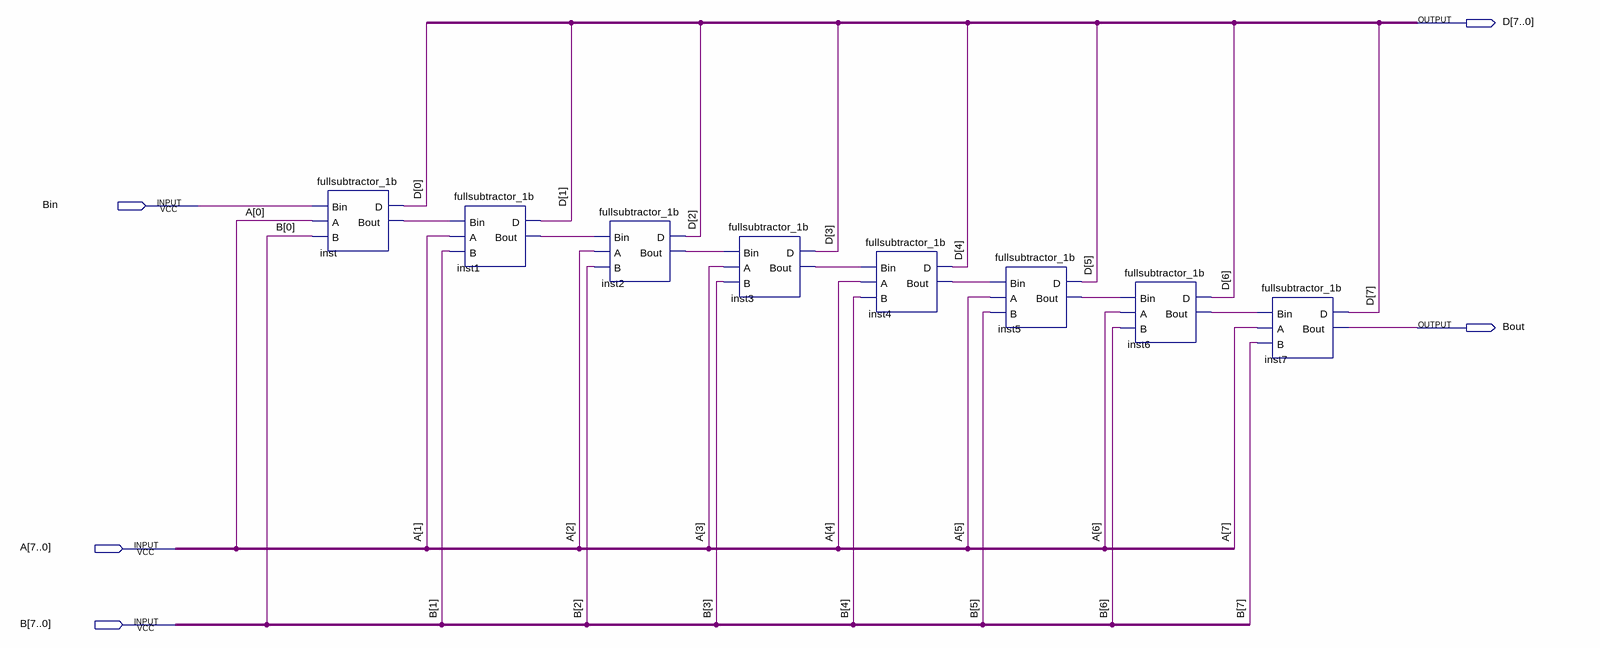
[diagram p0: schematic sheet]
// Quartus schematic RBS_8b_2w.bdf as structural Verilog: 8 symbols, 5 pins
module RBS_8b_2w (
  input  Bin,
  input  [7:0] A,
  input  [7:0] B,
  output [7:0] D,
  output Bout
);

  wire inst1_bout, inst2_bout, inst3_bout, inst4_bout, inst5_bout, inst6_bout, inst_bout;

  fullsubtractor_1b inst (.Bin(Bin), .A(A[0]), .B(B[0]), .D(D[0]), .Bout(inst_bout));
  fullsubtractor_1b inst1 (.Bin(inst_bout), .A(A[1]), .B(B[1]), .D(D[1]), .Bout(inst1_bout));
  fullsubtractor_1b inst2 (.Bin(inst1_bout), .A(A[2]), .B(B[2]), .D(D[2]), .Bout(inst2_bout));
  fullsubtractor_1b inst3 (.Bin(inst2_bout), .A(A[3]), .B(B[3]), .D(D[3]), .Bout(inst3_bout));
  fullsubtractor_1b inst4 (.Bin(inst3_bout), .A(A[4]), .B(B[4]), .D(D[4]), .Bout(inst4_bout));
  fullsubtractor_1b inst5 (.Bin(inst4_bout), .A(A[5]), .B(B[5]), .D(D[5]), .Bout(inst5_bout));
  fullsubtractor_1b inst6 (.Bin(inst5_bout), .A(A[6]), .B(B[6]), .D(D[6]), .Bout(inst6_bout));
  fullsubtractor_1b inst7 (.Bin(inst6_bout), .A(A[7]), .B(B[7]), .D(D[7]), .Bout(Bout));
endmodule
